# EasyEDA Pro project 四轮车板子.epro, board PCB4
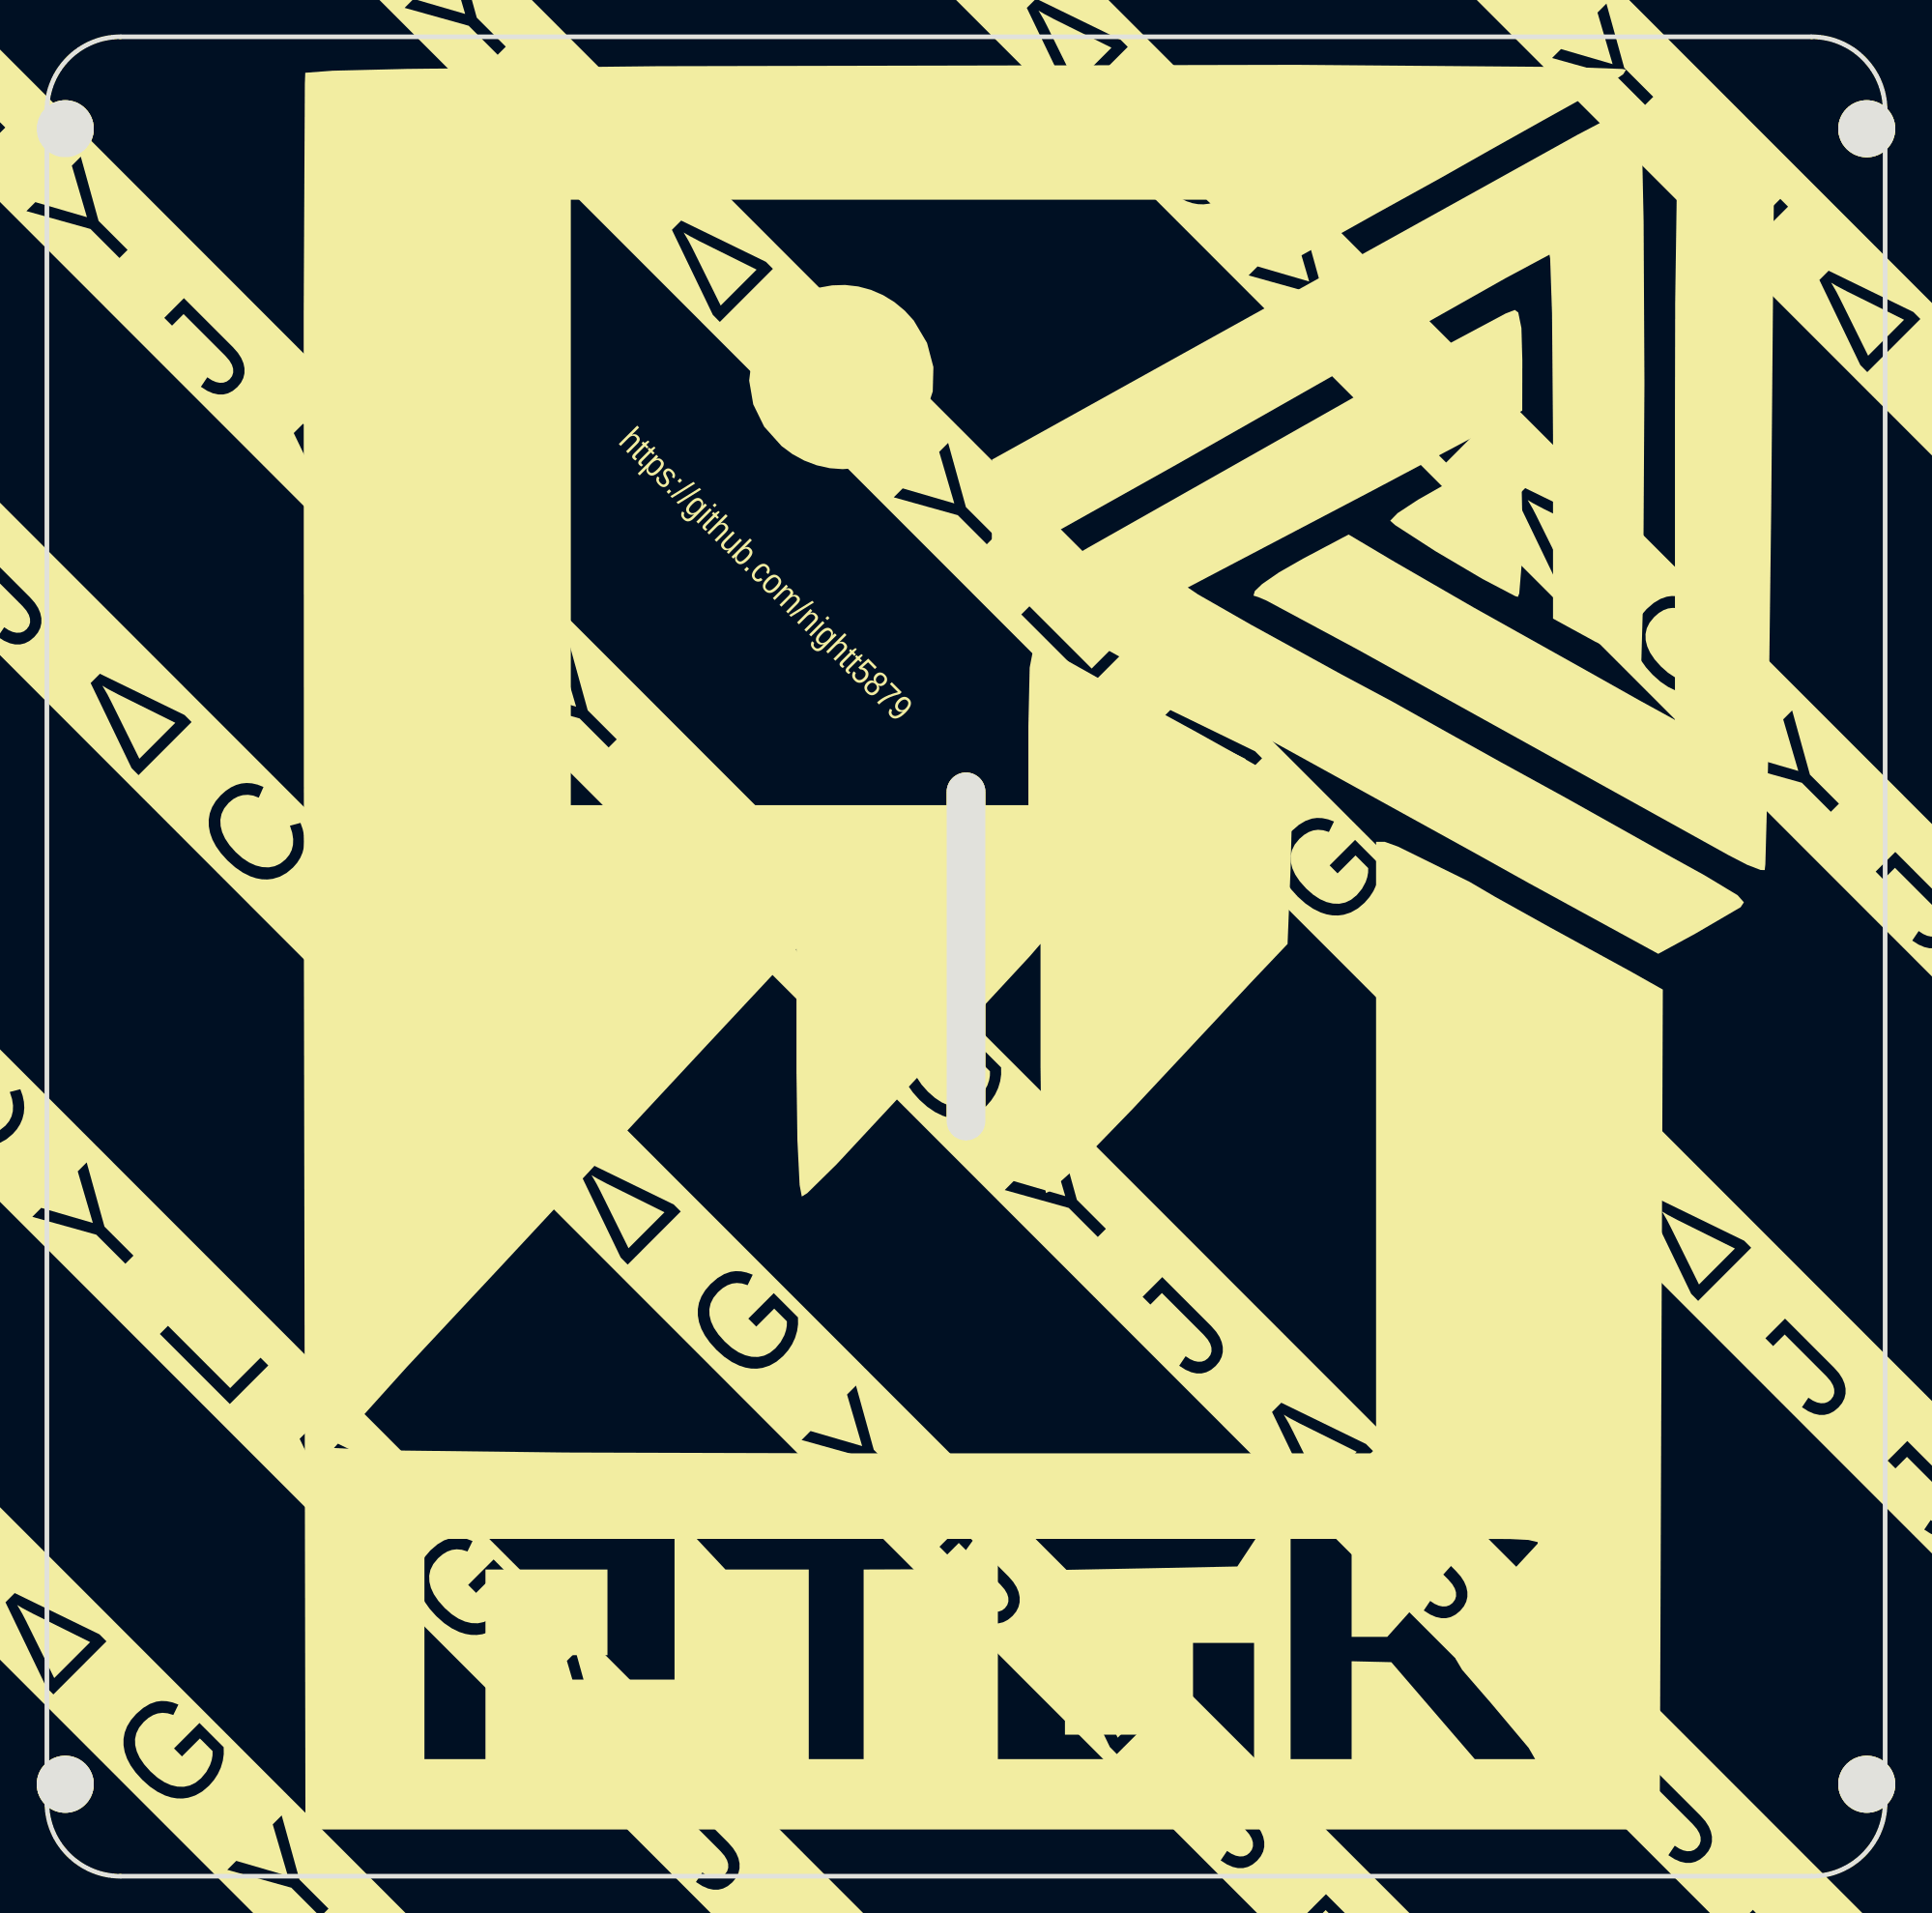
[diagram p14: board, top side]
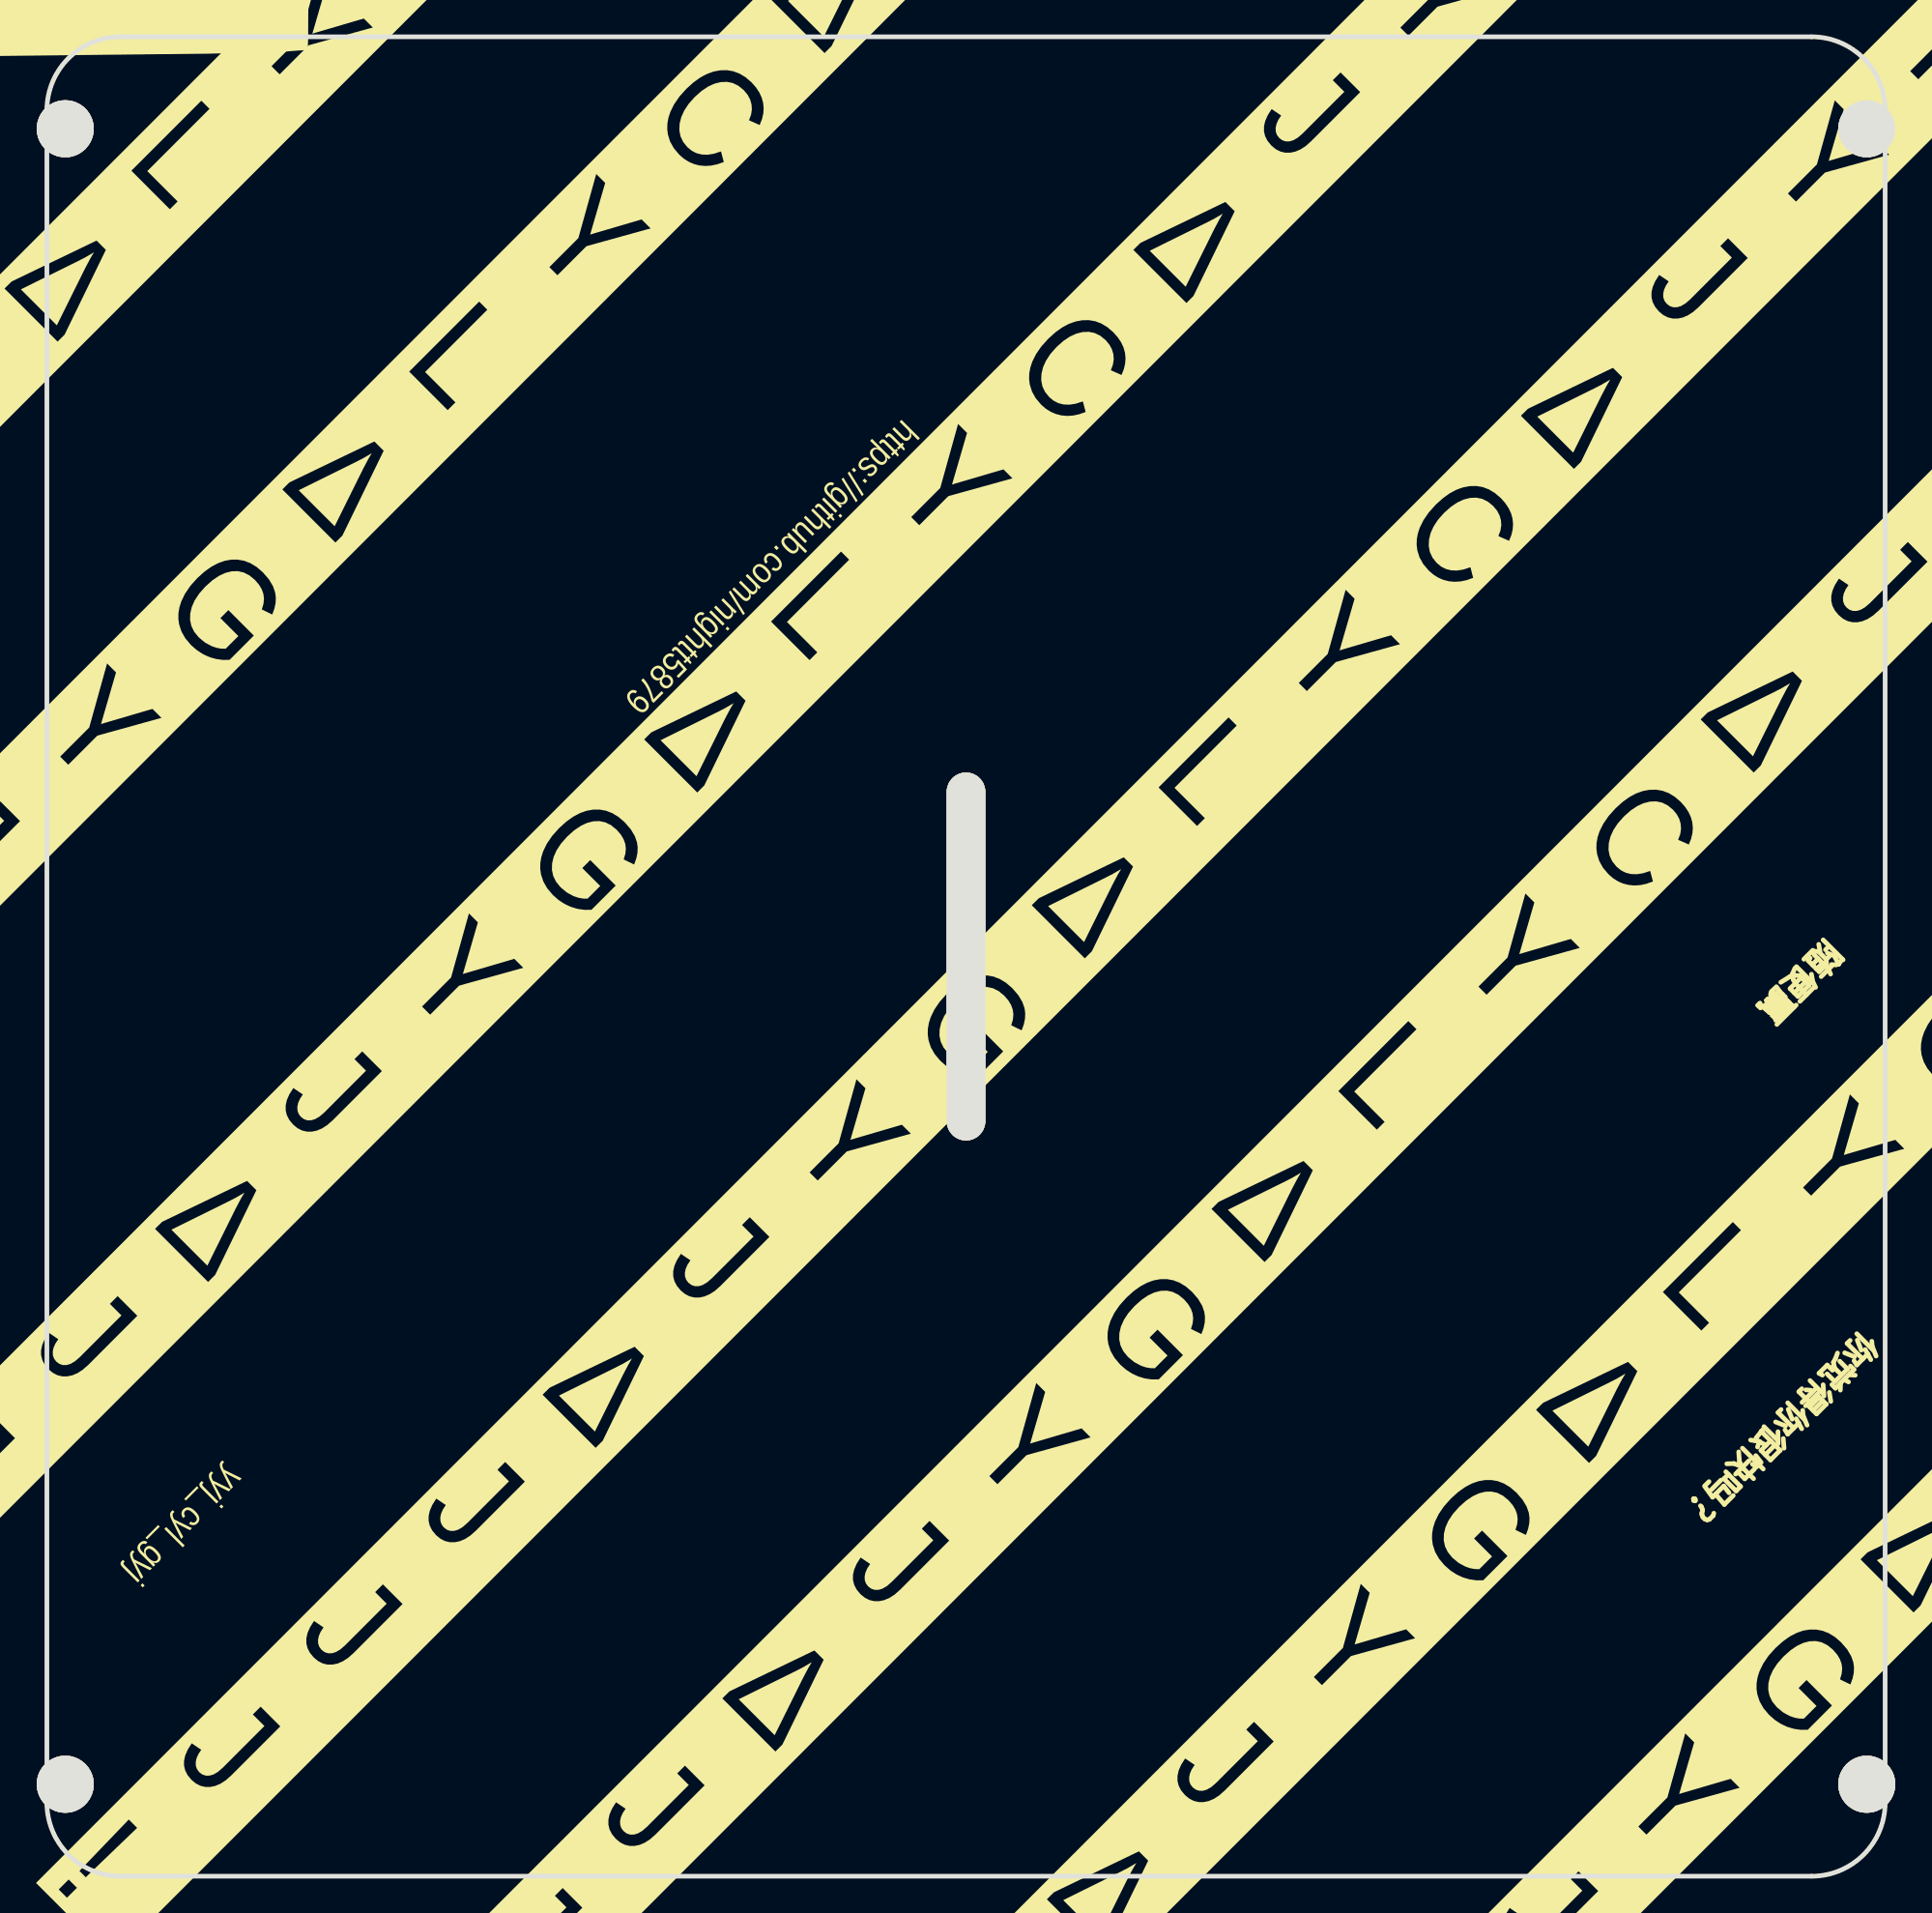
[diagram p15: board, bottom side, seen from below]

Outline 100 x 100 mm; copper layers: Top Layer, Bottom Layer. Coordinates in mm from the lower left corner of the outline.
Outline path: 0,96 0,4 arc(1.17,1.17) 4,0 96,0 arc(98.83,1.17) 100,4 100,96 arc(98.83,98.83) 96,100 4,100 arc(1.17,98.83) 0,96
Stack: Top Layer 0.035mm / Dielectric1 1.51mm FR4 er 4.5 / Bottom Layer 0.035mm

## Design rules (mm)
template: JLCPCB Capability(Two Layers Board)
spacing copperThickness1oz (default): track to track 0.102, other pairs 0.152 to 0.3
spacing copperThickness2oz: track to track 0.203, other pairs 0.152 to 0.3
track width copperThickness1oz (default): min 0.127, default 0.254, max 2.54
track width copperThickness2oz: min 0.203, default 0.254, max 2.54
differential pair differentialPair (default): width min 0.127, default 0.254, max 2.54; gap min 0.152, default 0.152
via viaSize (default): diameter min 0.5, default 0.61, max 10; hole min 0.3, default 0.305, max 6.3

## Placement (name value [footprint] x y rotation side)
NOREF  -  [Pad_e4]  1 5 0 top
NOREF#2  -  [Pad_e6]  99 5 0 top
NOREF#3  -  [Pad_e3]  50 50 0 top
NOREF#4  -  [Pad_e5]  99 95 0 top
NOREF#5  -  [Pad_e2]  1 95 0 top

## Footprints (pads in the part's own frame, mm; a bottom-side part is the same pattern mirrored in y, then rotated)
Pad_e2
  round 3.1 hole 3.1: 1(0,0)
Pad_e3
  oval 2.1x20 hole 2.1x20: 1(0,0)
Pad_e4
  round 3.1 hole 3.1: 1(0,0)
Pad_e5
  round 3.1 hole 3.1: 1(0,0)
Pad_e6
  round 3.1 hole 3.1: 1(0,0)

## Nets

Pads without a net: NOREF 1; NOREF#2 1; NOREF#3 1; NOREF#4 1; NOREF#5 1

## Text on the board
Bottom Silkscreen Layer: 你觉得你很快吗？ | 随便赢 | yyj_cyl_gyj | https://github.com/nightt5879 | Y / Y / J / Δ / C / Y / L / Δ / G / Y / J / Δ / J / J / J / !
Top Silkscreen Layer: https://github.com/nightt5879 | Y / Y / J / Δ / C / Y / L / Δ / G / Y / J / Δ / J / J / J / !
